# EAGLE design supervisor (EAGLE 5.08)
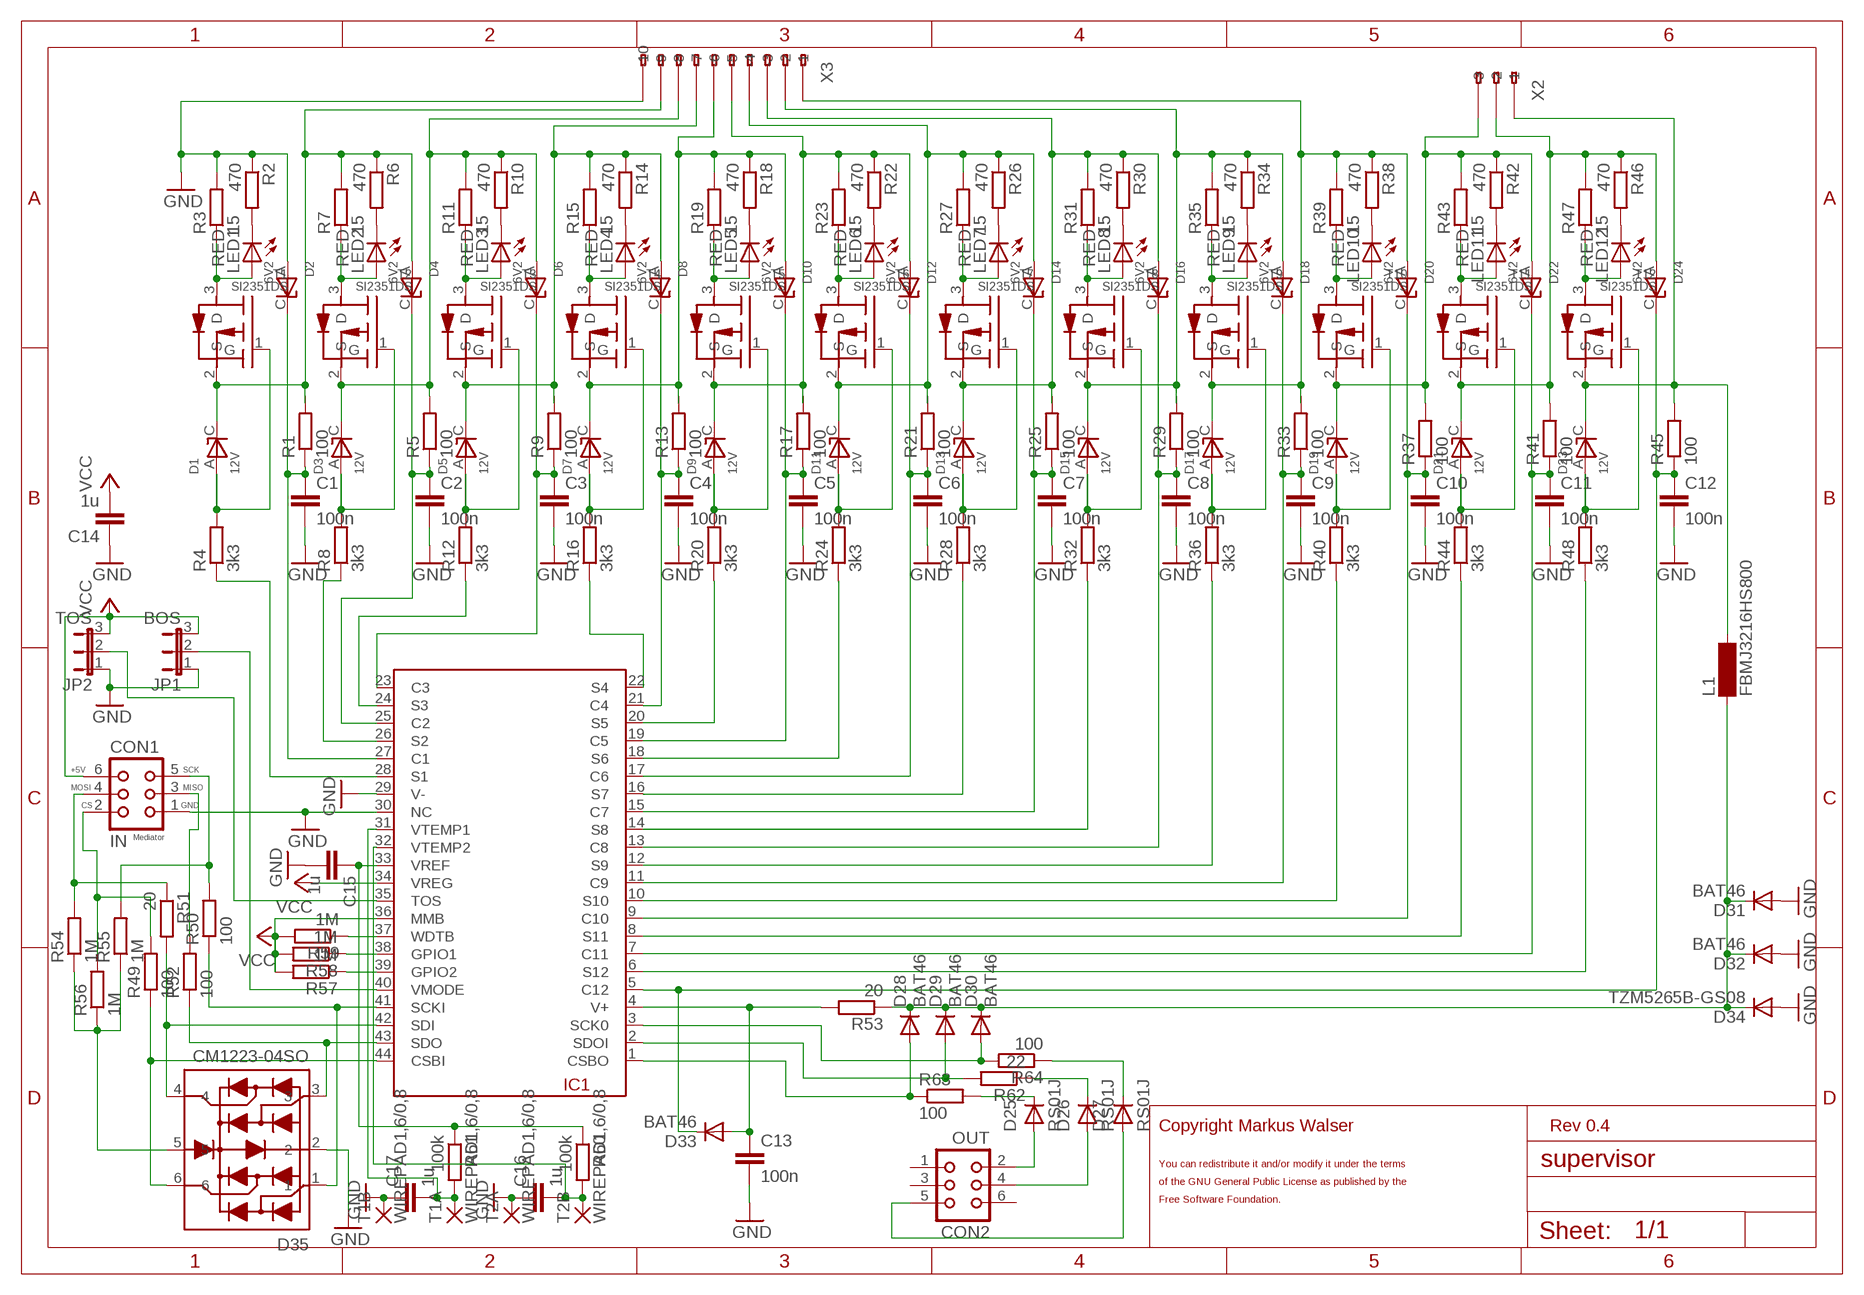
[diagram p0: schematic, sheet 1]

## Parts
C1  100n  C-EUC0603  [C0603]
C2  100n  C-EUC0603  [C0603]
C3  100n  C-EUC0603  [C0603]
C4  100n  C-EUC0603  [C0603]
C5  100n  C-EUC0603  [C0603]
C6  100n  C-EUC0603  [C0603]
C7  100n  C-EUC0603  [C0603]
C8  100n  C-EUC0603  [C0603]
C9  100n  C-EUC0603  [C0603]
C10  100n  C-EUC0603  [C0603]
C11  100n  C-EUC0603  [C0603]
C12  100n  C-EUC0603  [C0603]
C13  100n  C-EUC0603  [C0603]
C14  1u  C-EUC0603  [C0603]
C15  1u  C-EUC0603  [C0603]
C16  1u  C-EUC0603  [C0603]
C17  1u  C-EUC0603  [C0603]
CON1  IN  CON06L  [CON06L]
CON2  OUT  CON06L  [CON06L]
D1  12V  MM3Z12VT1  [SOD323-R]
D2  6V2  BZT52C6V2S  [SOD323-R]
D3  12V  MM3Z12VT1  [SOD323-R]
D4  6V2  BZT52C6V2S  [SOD323-R]
D5  12V  MM3Z12VT1  [SOD323-R]
D6  6V2  BZT52C6V2S  [SOD323-R]
D7  12V  MM3Z12VT1  [SOD323-R]
D8  6V2  BZT52C6V2S  [SOD323-R]
D9  12V  MM3Z12VT1  [SOD323-R]
D10  6V2  BZT52C6V2S  [SOD323-R]
D11  12V  MM3Z12VT1  [SOD323-R]
D12  6V2  BZT52C6V2S  [SOD323-R]
D13  12V  MM3Z12VT1  [SOD323-R]
D14  6V2  BZT52C6V2S  [SOD323-R]
D15  12V  MM3Z12VT1  [SOD323-R]
D16  6V2  BZT52C6V2S  [SOD323-R]
D17  12V  MM3Z12VT1  [SOD323-R]
D18  6V2  BZT52C6V2S  [SOD323-R]
D19  12V  MM3Z12VT1  [SOD323-R]
D20  6V2  BZT52C6V2S  [SOD323-R]
D21  12V  MM3Z12VT1  [SOD323-R]
D22  6V2  BZT52C6V2S  [SOD323-R]
D23  12V  MM3Z12VT1  [SOD323-R]
D24  6V2  BZT52C6V2S  [SOD323-R]
D25  RS01J  RS1J  [SMA-DO214AC]
D26  RS01J  RS1J  [SMA-DO214AC]
D27  RS01J  RS1J  [SMA-DO214AC]
D28  BAT46  DIODE-MINIMELF  [MINIMELF]
D29  BAT46  DIODE-MINIMELF  [MINIMELF]
D30  BAT46  DIODE-MINIMELF  [MINIMELF]
D31  BAT46  DIODE-MINIMELF  [MINIMELF]
D32  BAT46  DIODE-MINIMELF  [MINIMELF]
D33  BAT46  DIODE-MINIMELF  [MINIMELF]
D34  TZM5265B-GS08  DIODE-MINIMELF  [MINIMELF]
D35  CM1223-04SO  CM1223-04SOSOT23-6  [SOT23-6]
IC1  LTC6802-1  [SSOP44DL]
JP1  BOS  JP2E  [JP2]
JP2  TOS  JP2E  [JP2]
L1  FBMJ3216HS800  SM-1206  [SM-1206]
LED1  RED  LEDCHIPLED_0805  [CHIPLED_0805]
LED2  RED  LEDCHIPLED_0805  [CHIPLED_0805]
LED3  RED  LEDCHIPLED_0805  [CHIPLED_0805]
LED4  RED  LEDCHIPLED_0805  [CHIPLED_0805]
LED5  RED  LEDCHIPLED_0805  [CHIPLED_0805]
LED6  RED  LEDCHIPLED_0805  [CHIPLED_0805]
LED7  RED  LEDCHIPLED_0805  [CHIPLED_0805]
LED8  RED  LEDCHIPLED_0805  [CHIPLED_0805]
LED9  RED  LEDCHIPLED_0805  [CHIPLED_0805]
LED10  RED  LEDCHIPLED_0805  [CHIPLED_0805]
LED11  RED  LEDCHIPLED_0805  [CHIPLED_0805]
LED12  RED  LEDCHIPLED_0805  [CHIPLED_0805]
R1  100  R-EU_R0603  [R0603]
R2  470  R-EU_R0603  [R0603]
R3  15  R-EU_0411/12  [0411/12]
R4  3k3  R-EU_R0603  [R0603]
R5  100  R-EU_R0603  [R0603]
R6  470  R-EU_R0603  [R0603]
R7  15  R-EU_0411/12  [0411/12]
R8  3k3  R-EU_R0603  [R0603]
R9  100  R-EU_R0603  [R0603]
R10  470  R-EU_R0603  [R0603]
R11  15  R-EU_0411/12  [0411/12]
R12  3k3  R-EU_R0603  [R0603]
R13  100  R-EU_R0603  [R0603]
R14  470  R-EU_R0603  [R0603]
R15  15  R-EU_0411/12  [0411/12]
R16  3k3  R-EU_R0603  [R0603]
R17  100  R-EU_R0603  [R0603]
R18  470  R-EU_R0603  [R0603]
R19  15  R-EU_0411/12  [0411/12]
R20  3k3  R-EU_R0603  [R0603]
R21  100  R-EU_R0603  [R0603]
R22  470  R-EU_R0603  [R0603]
R23  15  R-EU_0411/12  [0411/12]
R24  3k3  R-EU_R0603  [R0603]
R25  100  R-EU_R0603  [R0603]
R26  470  R-EU_R0603  [R0603]
R27  15  R-EU_0411/12  [0411/12]
R28  3k3  R-EU_R0603  [R0603]
R29  100  R-EU_R0603  [R0603]
R30  470  R-EU_R0603  [R0603]
R31  15  R-EU_0411/12  [0411/12]
R32  3k3  R-EU_R0603  [R0603]
R33  100  R-EU_R0603  [R0603]
R34  470  R-EU_R0603  [R0603]
R35  15  R-EU_0411/12  [0411/12]
R36  3k3  R-EU_R0603  [R0603]
R37  100  R-EU_R0603  [R0603]
R38  470  R-EU_R0603  [R0603]
R39  15  R-EU_0411/12  [0411/12]
R40  3k3  R-EU_R0603  [R0603]
R41  100  R-EU_R0603  [R0603]
R42  470  R-EU_R0603  [R0603]
R43  15  R-EU_0411/12  [0411/12]
R44  3k3  R-EU_R0603  [R0603]
R45  100  R-EU_R0603  [R0603]
R46  470  R-EU_R0603  [R0603]
R47  15  R-EU_0411/12  [0411/12]
R48  3k3  R-EU_R0603  [R0603]
R49  100  R-EU_R0603  [R0603]
R50  100  R-EU_R0603  [R0603]
R51  20  R-EU_R0603  [R0603]
R52  100  R-EU_R0603  [R0603]
R53  20  R-EU_R0603  [R0603]
R54  1M  R-EU_R0603  [R0603]
R55  1M  R-EU_R0603  [R0603]
R56  1M  R-EU_R0603  [R0603]
R57  1M  R-EU_R0603  [R0603]
R58  1M  R-EU_R0603  [R0603]
R59  1M  R-EU_R0603  [R0603]
R60  100k  R-EU_R0603  [R0603]
R61  100k  R-EU_R0603  [R0603]
R62  22  R-EU_R0603  [R0603]
R63  100  R-EU_R0603  [R0603]
R64  100  R-EU_R0603  [R0603]
T1  SI2351DS  [SOT23]
T1A  WIREPAD1,6/0,8  [1,6/0,8]
T1B  WIREPAD1,6/0,8  [1,6/0,8]
T2  SI2351DS  [SOT23]
T2A  WIREPAD1,6/0,8  [1,6/0,8]
T2B  WIREPAD1,6/0,8  [1,6/0,8]
T3  SI2351DS  [SOT23]
T4  SI2351DS  [SOT23]
T5  SI2351DS  [SOT23]
T6  SI2351DS  [SOT23]
T7  SI2351DS  [SOT23]
T8  SI2351DS  [SOT23]
T9  SI2351DS  [SOT23]
T10  SI2351DS  [SOT23]
T11  SI2351DS  [SOT23]
T12  SI2351DS  [SOT23]
X2  233-503  [233-503]
X3  233-510  [233-510]

## Nets
GND: C1.2 C2.2 C3.2 C4.2 C5.2 C6.2 C7.2 C8.2 C9.2 C10.2 C11.2 C12.2 C13.2 C14.1 C15.2 C16.1 C17.1 CON1.1 D2.A D31.A D32.A D34.A D35.2 IC1.29(V-) IC1.30(NC) JP1.1 JP2.1 R2.1 R3.2 T1B.1(P) T2A.1(P) X3.A10(-10)
N$1: LED1.C R2.2
N$2: D1.A R4.2 T1.1(G)
N$3: LED1.A R3.1 T1.3(D)
N$4: C1.1 D2.C(K) IC1.27(C1) R1.1
N$5: D1.C(K) D4.A R1.2 R6.1 R7.2 T1.2(S) X3.A9(-9)
N$6: C2.1 D4.C(K) IC1.25(C2) R5.1
N$7: IC1.28(S1) R4.1
N$8: IC1.26(S2) R8.1
N$9: C5.1 D10.C(K) IC1.19(C5) R17.1
N$10: D3.A R8.2 T2.1(G)
N$11: LED2.A R7.1 T2.3(D)
N$12: LED2.C R6.2
N$13: D3.C(K) D6.A R5.2 R10.1 R11.2 T2.2(S) X3.A8(-8)
N$14: C3.1 D6.C(K) IC1.23(C3) R9.1
N$15: IC1.24(S3) R12.1
N$16: IC1.20(S5) R20.1
N$17: D5.A R12.2 T3.1(G)
N$18: LED3.A R11.1 T3.3(D)
N$19: LED3.C R10.2
N$20: D5.C(K) D8.A R9.2 R14.1 R15.2 T3.2(S) X3.A7(-7)
N$21: C4.1 D8.C(K) IC1.21(C4) R13.1
N$22: IC1.22(S4) R16.1
N$23: D9.A R20.2 T5.1(G)
N$24: D7.A R16.2 T4.1(G)
N$25: LED4.A R15.1 T4.3(D)
N$26: LED4.C R14.2
N$27: D7.C(K) D10.A R13.2 R18.1 R19.2 T4.2(S) X3.A6(-6)
N$28: D28.A IC1.1(CSBO) R63.1
N$29: LED5.A R19.1 T5.3(D)
N$30: LED5.C R18.2
N$31: D9.C(K) D12.A R17.2 R22.1 R23.2 T5.2(S) X3.A5(-5)
N$32: D29.A IC1.2(SDOI) R62.2
N$33: C6.1 D12.C(K) IC1.17(C6) R21.1
N$34: IC1.18(S6) R24.1
N$35: D11.A R24.2 T6.1(G)
N$36: LED6.A R23.1 T6.3(D)
N$37: LED6.C R22.2
N$38: D11.C(K) D14.A R21.2 R26.1 R27.2 T6.2(S) X3.A4(-4)
N$39: D30.A IC1.3(SCK0) R64.2
N$40: C7.1 D14.C(K) IC1.15(C7) R25.1
N$41: IC1.16(S7) R28.1
N$42: D13.A R28.2 T7.1(G)
N$43: LED7.A R27.1 T7.3(D)
N$44: LED7.C R26.2
N$45: D13.C(K) D16.A R25.2 R30.1 R31.2 T7.2(S) X3.A3(-3)
N$46: D35.1 IC1.41(SCKI) R50.1
N$47: C8.1 D16.C(K) IC1.13(C8) R29.1
N$48: IC1.14(S8) R32.1
N$49: D15.A R32.2 T8.1(G)
N$50: LED8.A R31.1 T8.3(D)
N$51: LED8.C R30.2
N$52: D15.C(K) D18.A R29.2 R34.1 R35.2 T8.2(S) X3.A2(-2)
N$53: D35.4 IC1.42(SDI) R51.2
N$54: C9.1 D18.C(K) IC1.11(C9) R33.1
N$55: IC1.12(S9) R36.1
N$56: D17.A R36.2 T9.1(G)
N$57: LED9.A R35.1 T9.3(D)
N$58: LED9.C R34.2
N$59: D17.C(K) D20.A R33.2 R38.1 R39.2 T9.2(S) X3.A1(-1)
N$60: D35.3 IC1.43(SDO) R52.1
N$61: C10.1 D20.C(K) IC1.9(C10) R37.1
N$62: IC1.10(S10) R40.1
N$63: D19.A R40.2 T10.1(G)
N$64: LED10.A R39.1 T10.3(D)
N$65: LED10.C R38.2
N$66: D19.C(K) D22.A R37.2 R42.1 R43.2 T10.2(S) X2.A3(-3)
N$67: D35.6 IC1.44(CSBI) R49.1
N$68: C11.1 D22.C(K) IC1.7(C11) R41.1
N$69: IC1.8(S11) R44.1
N$70: D21.A R44.2 T11.1(G)
N$71: LED11.A R43.1 T11.3(D)
N$72: LED11.C R42.2
N$73: D28.C D29.C D30.C D31.C D32.C D34.C L1.1 R53.1
N$74: D27.K(C) R64.1
N$75: C12.1 D24.C(K) D33.C IC1.5(C12) R45.1
N$76: IC1.6(S12) R48.1
N$77: D23.A R48.2 T12.1(G)
N$78: LED12.A R47.1 T12.3(D)
N$79: LED12.C R46.2
N$80: D23.C(K) L1.2 R45.2 T12.2(S) X2.A1(-1)
N$81: CON2.5 D27.A
N$82: D26.K(C) R62.1
N$83: C13.1 D33.A IC1.4(V+) R53.2
N$84: D21.C(K) D24.A R41.2 R46.1 R47.2 T11.2(S) X2.A2(-2)
N$85: IC1.35(TOS) JP2.2
N$86: D35.5 R54.1 R55.1 R56.1
N$87: IC1.37(WDTB) R59.1
N$88: IC1.38(GPIO1) R58.1
N$89: IC1.39(GPIO2) R57.1
N$90: C15.1 IC1.33(VREF) R60.1 R61.1
N$91: IC1.40(VMODE) JP1.2
N$92: CON1.2 R49.2 R56.2
N$93: CON1.3 R52.2
N$94: CON1.4 R51.1 R54.2
N$95: CON1.5 R50.2 R55.2
N$96: C16.2 IC1.32(VTEMP2) R60.2 T2B.1(P)
N$97: C17.2 IC1.31(VTEMP1) R61.2 T1A.1(P)
N$98: CON2.4 D26.A
N$99: D25.K(C) R63.2
N$100: CON2.2 D25.A
VCC: C14.2 CON1.6 IC1.34(VREG) IC1.36(MMB) JP1.3 JP2.3 R57.2 R58.2 R59.2
Unconnected: CON2.1 CON2.3 CON2.6 X2.B1(B-1) X2.B2(B-2) X2.B3(B-3) X3.B1(B-1) X3.B2(B-2) X3.B3(B-3) X3.B4(B-4) X3.B5(B-5) X3.B6(B-6) X3.B7(B-7) X3.B8(B-8) X3.B9(B-9) X3.B10(B-10)

## Notes on the sheet
- +5V | SCK
- MOSI | MISO
- CS | GND
- Mediator
- Copyright Markus Walser | Rev 0.4
- You can redistribute it and/or modify it under the terms
- of the GNU General Public License as published by the
- Free Software Foundation.

## Library data of the parts
C1-C17 = resistor:C-EU: CAPACITOR, European symbol
CON1 CON2 = con-harting:CON06L: CONNECTOR
D1 D3 D5 D7 D9 D11 D13 D15 D17 D19 D21 D23 = icontroller:MM3Z12VT1: 12V Z-Diode
D2 D4 D6 D8 D10 D12 D14 D16 D18 D20 D22 D24 = icontroller:BZT52C6V2S: 6.2V Z-Diode
D25-D27 = icontroller:RS1J
D28-D34 = diode:DIODE-: DIODE
D35 = icontroller:CM1223-04SO: CMD LOW CAPACITANCE ESD PROTECTION ARRAYS WITH BACKDRIVE PROTECTION
IC1 = ltc6802:LTC6802-1
JP1 JP2 = jumper:JP2E: JUMPER
L1 = inductor-neosid:SM-1206: INDUCTOR SMD chip inductor
LED1-LED12 = led:LED: LED OSRAM: - CHIPLED LG R971, LG N971, LY N971, LG Q971, LY Q971, LO R971, LY R971 LH N974, LH R974 LS Q976, LO Q976, LY Q976 LO Q996 - Hyper CHIPLED LW Q18S LB Q993, LB Q99A, LB R99A - SideLED LS A670, LO A670, LY A670, LG A670, LP A670 LB A673, LV A673, LT A673, LW A673 LH A674 LY A675 LS A676, LA A676, LO A676, LY A676, LW A676 LS A679, LY A679, LG A679 - Hyper Micro SIDELED® LS Y876, LA Y876, LO Y876, LY Y876 LT Y87S - SmartLED LW L88C, LW L88S LB L89C, LB L89S, LG L890 LS L89K, LO L89K, LY L89K LS L896, LA L896, LO L896, LY L896 - TOPLED LS T670, LO T670, LY T670, LG T670, LP T670 LSG T670, LSP T670, LSY T670, LOP T670, LYG T670 LG T671, LOG T671, LSG T671 LB T673, LV T673, LT T673, LW T673 LH T674 LS T676, LA T676, LO T676, LY T676, LB T676, LH T676, LSB T676, LW T676 LB T67C, LV T67C, LT T67C, LS T67K, LO T67K, LY T67K, LW E67C LS E67B, LA E67B, LO E67B, LY E67B, LB E67C, LV E67C, LT E67C LW T67C LS T679, LY T679, LG T679 LS T770, LO T770, LY T770, LG T770, LP T770 LB T773, LV T773, LT T773, LW T773 LH T774 LS E675, LA E675, LY E675, LS T675 LS T776, LA T776, LO T776, LY T776, LB T776 LHGB T686 LT T68C, LB T68C - Hyper Mini TOPLED® LB M676 - Mini TOPLED Santana® LG M470 LS M47K, LO M47K, LY M47K Source: http://www.osram.convergy.de LUXEON: - LUMILED® LXK2-PW12-R00, LXK2-PW12-S00, LXK2-PW14-U00, LXK2-PW14-V00 LXK2-PM12-R00, LXK2-PM12-S00, LXK2-PM14-U00 LXK2-PE12-Q00, LXK2-PE12-R00, LXK2-PE12-S00, LXK2-PE14-T00, LXK2-PE14-U00 LXK2-PB12-K00, LXK2-PB12-L00, LXK2-PB12-M00, LXK2-PB14-N00, LXK2-PB14-P00, LXK2-PB14-Q00 LXK2-PR12-L00, LXK2-PR12-M00, LXK2-PR14-Q00, LXK2-PR14-R00 LXK2-PD12-Q00, LXK2-PD12-R00, LXK2-PD12-S00 LXK2-PH12-R00, LXK2-PH12-S00 LXK2-PL12-P00, LXK2-PL12-Q00, LXK2-PL12-R00 Source: www.luxeon.com KINGBRIGHT: KA-3528ASYC Source: www.kingbright.com
R1-R64 = resistor:R-EU_: RESISTOR, European symbol
T1-T12 = icontroller:SI2351DS
T1A T1B T2A T2B = wirepad:WIREPAD: Wire PAD connect wire on PCB
X2 = con-wago:233-503: WAGO Cage Clamp
X3 = con-wago:233-510: WAGO Cage Clamp

## Board
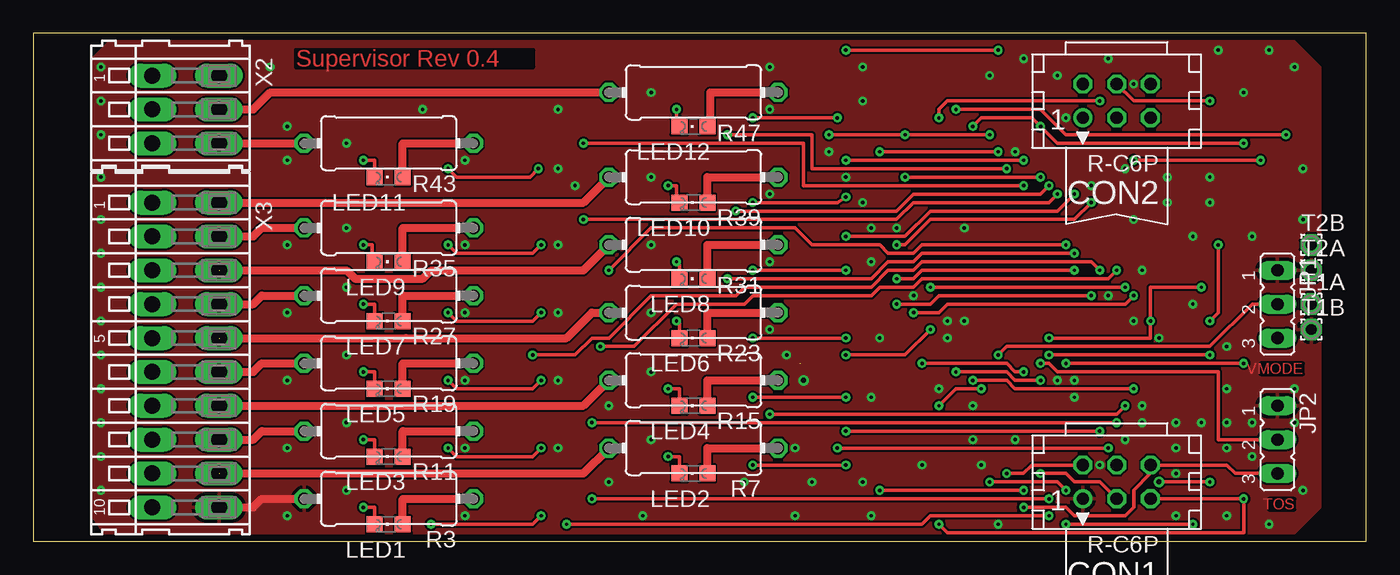
[diagram p1: board, top side]
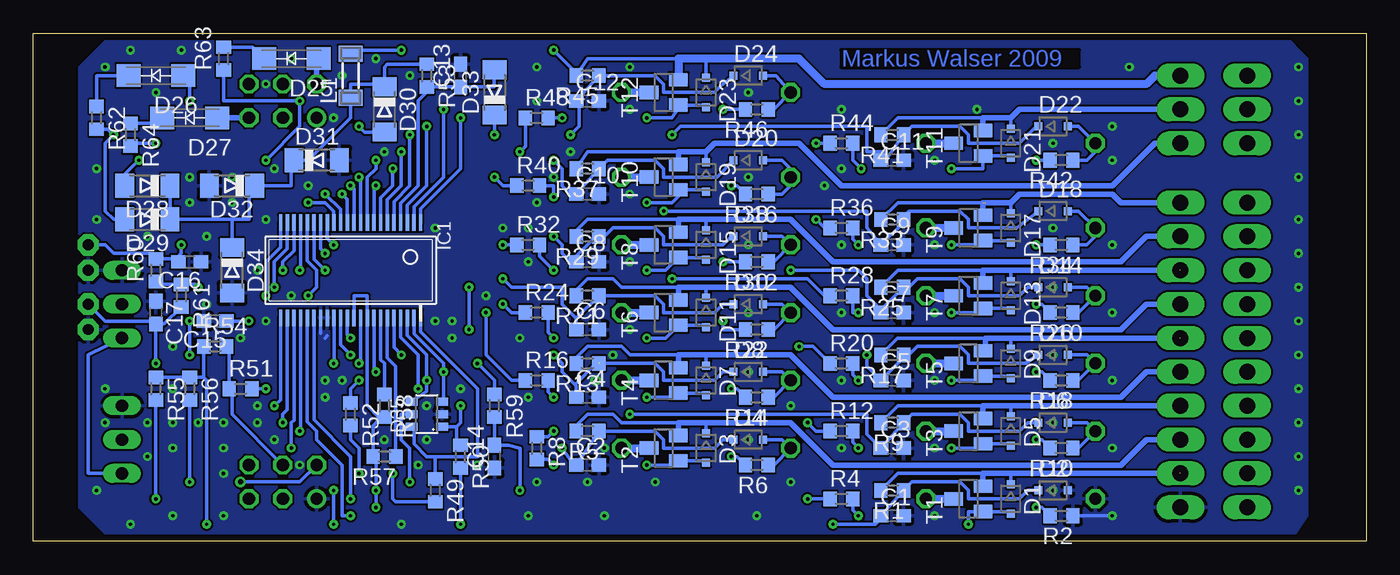
[diagram p2: board, bottom side, seen from below]

Size 100 x 38.09 mm. Coordinates in mm from the lower left corner, seen from the top.
Outline: 0,0 100,0 100,38.09 0,38.09 0,0
Copper layers (1*16): Top 0.035mm / dielectric 1.5mm / Bottom 0.035mm
Design rules "default *": minimum track width 6mil, minimum drill 10mil, track to track 6mil, track to pad 6mil, pad to pad 6mil, via to via 6mil, smd to smd 6mil, copper to edge 20mil, drill to drill 8mil, minimum pad ring 10mil, minimum via ring 8mil, stop-mask expansion 4mil, vias tented up to drill 25mil, thermal gap 10mil

### Footprints (pad centres in the part's own frame; a part is rotated, then mirrored left to right if it is on the bottom)
C0603 = smd 1.1 x 1: 1 -0.85,0; 2 0.85,0
CON06L = drill 0.914 round: 1 2.54,1.27 | drill 0.914 octagon: 2 2.54,-1.27; 3 0,1.27; 4 0,-1.27; 5 -2.54,1.27; 6 -2.54,-1.27
SOD323-R = smd 0.6 x 0.6: A 1.1,0; C -1.1,0
SMA-DO214AC = smd 1.8 x 1.7: A -2.05,0; K 2.05,0
MINIMELF = smd 1.4 x 1.8: A 1.7,0; C -1.7,0
SOT23-6 = smd 0.6 x 0.9: 1 -0.95,-1.15; 2 0,-1.15; 3 0.95,-1.15; 4 0.95,1.15; 5 0,1.15; 6 -0.95,1.15
SSOP44DL = smd 0.25 x 1.25: 1 -5.25,-3.575; 2 -4.75,-3.575; 3 -4.25,-3.575; 4 -3.75,-3.575; 5 -3.25,-3.575; 6 -2.75,-3.575; 7 -2.25,-3.575; 8 -1.75,-3.575; 9 -1.25,-3.575; 10 -0.75,-3.575; 11 -0.25,-3.575; 12 0.25,-3.575; 13 0.75,-3.575; 14 1.25,-3.575; 15 1.75,-3.575; 16 2.25,-3.575; 17 2.75,-3.575; 18 3.25,-3.575; 19 3.75,-3.575; 20 4.25,-3.575; 21 4.75,-3.575; 22 5.25,-3.575; 23 5.25,3.575; 24 4.75,3.575; 25 4.25,3.575; 26 3.75,3.575; 27 3.25,3.575; 28 2.75,3.575; 29 2.25,3.575; 30 1.75,3.575; 31 1.25,3.575; 32 0.75,3.575; 33 0.25,3.575; 34 -0.25,3.575; 35 -0.75,3.575; 36 -1.25,3.575; 37 -1.75,3.575; 38 -2.25,3.575; 39 -2.75,3.575; 40 -3.25,3.575; 41 -3.75,3.575; 42 -4.25,3.575; 43 -4.75,3.575; 44 -5.25,3.575
JP2 = drill 0.914 long: 1 -2.54,0; 2 0,0; 3 2.54,0
SM-1206 = smd 1.2 x 1.8: 1 -1.65,0; 2 1.65,0
CHIPLED_0805 = smd 1.2 x 1.2: A 0,-1.05; C 0,1.05
R0603 = smd 1 x 1.1: 1 -0.85,0; 2 0.85,0
0411/12 = drill 0.914 octagon: 1 -6.35,0; 2 6.35,0
SOT23 = smd 1 x 1.4: 1 -0.95,-1.1; 2 0.95,-1.1; 3 0,1.1
1,6/0,8 = drill 0.813 pad 1.6 octagon: 1 0,0
233-503 = drill 1.2 long: A1 -2.54,2.5; A2 0,2.5; A3 2.54,2.5; B1 -2.54,-2.5; B2 0,-2.5; B3 2.54,-2.5
233-510 = drill 1.2 long: A1 -11.43,2.5; A2 -8.89,2.5; A3 -6.35,2.5; A4 -3.81,2.5; A5 -1.27,2.5; A6 1.27,2.5; A7 3.81,2.5; A8 6.35,2.5; A9 8.89,2.5; A10 11.43,2.5; B1 -11.43,-2.5; B2 -8.89,-2.5; B3 -6.35,-2.5; B4 -3.81,-2.5; B5 -1.27,-2.5; B6 1.27,-2.5; B7 3.81,-2.5; B8 6.35,-2.5; B9 8.89,-2.5; B10 11.43,-2.5

### Placement (x,y rotation side)
C1  35.56,1.91 0 bottom
C2  58.42,5.71 0 bottom
C3  35.56,6.99 0 bottom
C4  58.42,10.79 0 bottom
C5  35.56,12.06 0 bottom
C6  58.42,15.88 0 bottom
C7  35.56,17.14 0 bottom
C8  58.42,20.95 0 bottom
C9  35.56,22.23 0 bottom
C10  58.42,26.04 0 bottom
C11  35.56,28.57 0 bottom
C12  58.42,33.02 0 bottom
C13  67.94,34.92 90 bottom
C14  65.41,6.35 90 bottom
C15  86.36,16.51 180 bottom
C16  88.27,20.95 180 bottom
C17  90.81,17.14 270 bottom
CON1  81.28,4.45 180 top
CON2  81.28,33.02 180 top
D1  26.67,3.17 270 bottom
D2  23.5,3.81 0 bottom
D3  49.53,6.99 270 bottom
D4  46.35,7.62 0 bottom
D5  26.67,8.26 270 bottom
D6  23.5,8.89 0 bottom
D7  49.53,12.06 270 bottom
D8  46.35,12.7 0 bottom
D9  26.67,13.34 270 bottom
D10  23.5,13.97 0 bottom
D11  49.53,17.14 270 bottom
D12  46.35,17.78 0 bottom
D13  26.67,18.41 270 bottom
D14  23.5,19.05 0 bottom
D15  49.53,22.23 270 bottom
D16  46.35,22.86 0 bottom
D17  26.67,23.5 270 bottom
D18  23.5,24.77 0 bottom
D19  49.53,27.3 270 bottom
D20  46.35,28.57 0 bottom
D21  26.67,29.84 270 bottom
D22  23.5,31.11 0 bottom
D23  49.53,33.66 270 bottom
D24  46.35,34.92 0 bottom
D25  80.64,36.2 180 bottom
D26  90.81,34.92 180 bottom
D27  88.27,31.75 180 bottom
D28  91.44,26.67 180 bottom
D29  91.44,24.13 180 bottom
D30  73.66,32.38 270 bottom
D31  78.74,28.57 0 bottom
D32  85.09,26.67 180 bottom
D33  65.41,33.66 90 bottom
D34  85.09,20.32 270 bottom
D35  70.48,9.53 90 bottom
IC1  76.2,20.32 180 bottom
JP1  93.34,17.78 270 top
JP2  93.34,7.62 270 top
L1  76.2,34.92 90 bottom
LED1  26.67,1.27 90 top
LED2  49.53,5.08 90 top
LED3  26.67,6.35 90 top
LED4  49.53,10.16 90 top
LED5  26.67,11.43 90 top
LED6  49.53,15.24 90 top
LED7  26.67,16.51 90 top
LED8  49.53,19.68 90 top
LED9  26.67,20.95 90 top
LED10  49.53,25.4 90 top
LED11  26.67,27.3 90 top
LED12  49.53,31.11 90 top
R1  35.56,3.81 180 bottom
R2  22.86,1.91 180 bottom
R3  26.67,3.17 180 top
R4  39.37,3.17 0 bottom
R5  58.42,8.26 180 bottom
R6  45.72,5.71 180 bottom
R7  49.53,6.99 180 top
R8  62.23,6.99 270 bottom
R9  35.56,8.89 180 bottom
R10  22.86,6.99 180 bottom
R11  26.67,8.26 180 top
R12  39.37,8.26 0 bottom
R13  58.42,13.34 180 bottom
R14  45.72,10.79 180 bottom
R15  49.53,12.06 180 top
R16  62.23,12.06 0 bottom
R17  35.56,13.97 180 bottom
R18  22.86,12.06 180 bottom
R19  26.67,13.34 180 top
R20  39.37,13.34 0 bottom
R21  58.42,18.41 180 bottom
R22  45.72,15.88 180 bottom
R23  49.53,17.14 180 top
R24  62.23,17.14 0 bottom
R25  35.56,19.05 180 bottom
R26  22.86,17.14 180 bottom
R27  26.67,18.41 180 top
R28  39.37,18.41 0 bottom
R29  58.42,22.86 180 bottom
R30  45.72,20.95 180 bottom
R31  49.53,22.23 180 top
R32  62.87,22.23 0 bottom
R33  35.56,24.13 180 bottom
R34  22.86,22.23 180 bottom
R35  26.67,23.5 180 top
R36  39.37,23.5 0 bottom
R37  58.42,27.94 180 bottom
R38  45.72,26.04 180 bottom
R39  49.53,27.3 180 top
R40  62.87,26.67 0 bottom
R41  35.56,30.48 180 bottom
R42  22.86,28.57 180 bottom
R43  26.67,29.84 180 top
R44  39.37,29.84 0 bottom
R45  58.42,34.92 180 bottom
R46  45.72,32.38 180 bottom
R47  49.53,33.66 180 top
R48  62.23,31.75 0 bottom
R49  69.85,3.81 270 bottom
R50  67.94,6.35 270 bottom
R51  84.45,11.43 0 bottom
R52  76.2,9.53 270 bottom
R53  70.48,34.92 270 bottom
R54  86.36,14.61 0 bottom
R55  90.81,11.43 270 bottom
R56  88.27,11.43 270 bottom
R57  73.66,6.35 180 bottom
R58  73.66,10.16 270 bottom
R59  65.41,10.16 270 bottom
R60  90.81,20.32 90 bottom
R61  88.9,18.41 270 bottom
R62  95.25,31.75 270 bottom
R63  85.72,36.2 90 bottom
R64  92.71,30.48 270 bottom
T1  29.84,3.17 90 bottom
T1A  95.89,17.78 0 top
T1B  95.89,15.88 0 top
T2  52.7,6.99 90 bottom
T2A  95.89,20.32 0 top
T2B  95.89,22.23 0 top
T3  29.84,8.26 90 bottom
T4  52.7,12.06 90 bottom
T5  29.84,13.34 90 bottom
T6  52.7,17.14 90 bottom
T7  29.84,18.41 90 bottom
T8  52.7,22.23 90 bottom
T9  29.84,23.5 90 bottom
T10  52.7,27.3 90 bottom
T11  29.84,29.84 90 bottom
T12  52.7,33.66 90 bottom
X2  11.43,32.38 270 top
X3  11.43,13.97 270 top

### Tracks (layer width: path | path; a pad name or v marks a point on that pad's centre or on a via)
GND  (via drill 0.25 pad 0.25, 0.38 pad 0.25)
  Top 0.61: R3.2 17.14,3.17 16.51,2.54 X3.A10
  Bottom 0.254: 21.59,1.91 R2.1 v19.05,1.91 | 77.95,15.39 78.11,15.24 | IC1.29 78.45,15.59
  other vias: 19.05,6.99 19.05,12.06 19.05,17.14 19.05,22.23 19.05,28.57 17.78,35.56 32.38,28.57 39.37,17.14 39.37,22.23 39.37,12.06 39.37,6.99 32.38,1.91 43.18,4.45 62.23,4.45 63.5,15.24 62.87,10.79 57.15,6.99 57.78,12.06 55.24,15.88 62.87,23.5 55.24,20.95 62.87,20.95 32.38,12.06 32.38,6.99 39.37,27.94 32.38,22.23 32.38,17.14 55.24,26.04 55.24,32.38 39.37,32.38 62.23,35.56 59.69,29.21 62.23,33.02 64.77,23.5 79.38,26.67 74.3,36.2 85.09,27.3 90.81,33.66 87,22.86 91.44,22.86 92.71,36.83 67.94,11.43 70.48,10.16 71.12,5.71 62.87,1.91 5.08,35.56 5.08,33.02 5.08,30.48 5.08,27.3 5.08,24.13 5.08,21.59 5.08,19.05 5.08,16.51 5.08,13.97 5.08,11.43 5.08,8.89 5.08,6.35 5.08,3.81 66.67,5.71 78.11,10.79 85.72,8.89 89.53,1.91 85.72,6.99 92.71,1.27 85.09,25.4 19.05,31.11 87,17.78 85.72,5.08 89.53,8.89 88.27,25.4 45.72,1.91 57.15,1.91 73.66,29.21 88.9,36.83 88.27,27.3 95.25,27.94 80.64,36.2 94.61,35.56 77.47,31.75 72.39,1.27 69.85,16.51 66.04,18.41 40.64,26.67 55.24,35.56 43.18,10.16 23.5,13.97 23.5,8.89 23.5,19.05 23.5,23.5 23.5,29.84 46.35,33.66 46.35,27.3 46.35,22.23 46.35,12.7 46.35,7.62 46.35,17.14 62.23,25.4 58.42,4.45 53.34,4.45 83.19,20.32 85.72,1.91 76.83,34.92 68.58,15.24 69.85,23.5 80.64,18.41 81.92,7.62 83.19,8.89 80.01,5.71 82.55,34.29 71.75,34.92 68.58,16.51 82.55,16.51 89.53,14.61 84.45,15.24 89.53,11.43 87.63,8.89 60.96,27.3 70.48,7.62 73.66,7.62 95.25,24.13 82.55,24.13 56.52,13.97 76.83,12.06 23.5,3.81 29.21,32.38 83.19,10.16 89.53,6.99 91.44,6.35 91.44,8.89 94.61,8.89 94.61,11.43 95.25,3.81 78.11,12.06 81.92,27.94
  pour Bottom: 6.35,38.1 93.98,38.1 96.52,35.56 96.52,2.54 93.98,0 5.71,0 4.45,1.91 4.45,36.2
  pour Top: 6.35,38.1 93.98,38.1 96.52,35.56 96.52,2.54 93.98,0 5.71,0 4.45,1.91 4.45,36.2
N$1  (via drill 0.25 pad 0.25)
  Top 0.254: v24.77,2.54 25.62,2.54 LED1.C
  Bottom 0.254: R2.2 24.34,2.54 v24.77,2.54
N$2  (via drill 0.25 pad 0.25)
  Top 0.254: v29.84,1.27 37.47,1.27 v38.1,1.91
  Bottom 0.254: D1.A 26.54,2.23 T1.1 29.84,2.23 v29.84,1.27 | v38.1,1.91 38.52,2.33 R4.2
N$3
  Top 0.61: LED1.A 27.72,3.17 R3.1
  Bottom 0.61: R3.1 T1.3
N$4  (via drill 0.25)
  Top 0.254: v40.01,1.27 66.67,1.27 67.31,1.91 v76.2,1.91
  Bottom 0.254: 34.8,3.7 R1.1 | 34.8,3.7 C1.1 36.41,1.69 36.83,1.27 v40.01,1.27 | D2.C 25.4,3.81 26.04,3.17 29.84,3.17 29.84,3.81 30.48,4.45 34.06,4.45 34.8,3.7 | v76.2,1.91 76.83,1.91 76.83,5.71 78.74,7.62 78.74,8.26 79.45,8.96 IC1.27
N$5  (1 unrouted)
  Top 0.61: R7.2 41.27,5.08 X3.A9
  Bottom 0.254: D4.A 43.81,7.62 R7.2 44.45,5.71 R6.1 | R1.2 35.14,5.08 28.57,5.08 | 26.67,5.08 D1.C
  Bottom 0.406: 13.97,5.08 26.67,5.08 28.57,5.08 28.75,5.08 T1.2
N$6  (via drill 0.25)
  Top 0.254: v60.33,6.99 v80.64,6.99
  Bottom 0.254: D4.C 48.26,7.62 48.9,6.99 52.7,6.99 52.7,7.62 53.34,8.26 R5.1 C2.1 59.27,5.5 v60.33,6.99 | v80.64,6.99 80.64,8.89 80.45,9.09 IC1.25
N$7  (via drill 0.25)
  Top 0.254: v41.91,3.17 v76.2,3.17
  Bottom 0.254: v76.2,3.17 76.2,6.35 78.95,9.1 IC1.28 | R4.1 v41.91,3.17
N$8  (via drill 0.25)
  Top 0.254: v60.96,8.26 v80.01,8.26
  Bottom 0.254: R8.1 61.38,7.83 v60.96,8.26 | IC1.26 79.95,8.31 v80.01,8.26
N$9  (via drill 0.25 pad 0.2, 0.25 pad 0.25)
  Top 0.254: v80.01,20.32 79.38,20.95 66.67,20.95 66.04,20.32 64.14,20.32 62.87,19.05 53.34,19.05 52.7,18.41 46.35,18.41 43.18,15.24 41.91,15.24 40.64,13.97 v37.47,13.97
  Bottom 0.254: D10.C 25.58,13.34 29.84,13.34 29.84,13.97 30.48,14.61 33.66,14.61 34.29,13.97 R17.1 34.71,13.77 C5.1 37.47,13.12 v37.47,13.97 | IC1.19 79.95,20.38 v80.01,20.32
N$10  (via drill 0.25 pad 0.25)
  Top 0.254: v53.98,5.71 v60.96,5.71
  Bottom 0.254: D3.A 49.4,6.04 T2.1 51.92,5.71 v53.98,5.71 | v60.96,5.71 61.38,6.13 R8.2
N$11
  Top 0.61: LED2.A 50.58,6.99 R7.1
  Bottom 0.61: R7.1 T2.3
N$12  (via drill 0.25 pad 0.25)
  Top 0.254: v47.62,6.35 48.48,6.35 LED2.C
  Bottom 0.254: v47.62,6.35 47.2,6.35 R6.2
N$13
  Top 0.61: R11.2 17.14,8.26 16.51,7.62 X3.A8
  Bottom 0.254: D6.A 20.95,8.89 R11.2 21.59,6.99 R10.1 | R5.2 59.27,8.68 58.42,9.53 56.52,9.53 55.88,8.89 49.53,8.89 D3.C
  Bottom 0.406: X3.A8 16.51,7.62 18.41,5.71 25.4,5.71 27.94,5.71 40.01,5.71 43.18,8.89 49.53,8.89 51.6,8.89 T2.2
N$14  (via drill 0.25, 0.25 pad 0.25)
  Top 0.254: v55.24,9.53 81.28,9.53 v81.92,10.16
  Bottom 0.254: D6.C 25.4,8.89 26.04,8.26 29.84,8.26 29.84,8.89 30.48,9.53 34.08,9.53 R9.1 C3.1 37.47,8.04 37.47,9.53 v55.24,9.53 | v81.92,10.16 81.45,10.62 IC1.23
N$15  (via drill 0.25, 0.25 pad 0.25)
  Top 0.254: v41.91,8.89 v81.28,8.89
  Bottom 0.254: R12.1 41.27,8.26 v41.91,8.89 | v81.28,8.89 81.28,9.53 80.95,9.86 IC1.24
N$16  (via drill 0.25 pad 0.25)
  Top 0.254: v81.28,20.32 80.64,19.68 66.67,19.68 66.04,19.05 63.5,19.05 62.87,18.41 53.98,18.41 53.34,17.78 48.26,17.78 45.09,14.61 v42.55,14.61
  Bottom 0.254: v42.55,14.61 41.49,14.61 R20.1 | v81.28,20.32 81.28,20.95 80.45,21.79 IC1.20
N$17  (via drill 0.25 pad 0.25)
  Top 0.254: v31.11,6.99 31.75,6.35 37.47,6.35 v38.1,6.99
  Bottom 0.254: D5.A 26.54,7.3 T3.1 29.07,6.99 v31.11,6.99 | v38.1,6.99 38.52,7.41 R12.2
N$18
  Top 0.61: LED3.A 27.72,8.26 R11.1
  Bottom 0.61: R11.1 T3.3
N$19  (via drill 0.25 pad 0.25)
  Top 0.254: LED3.C 25.62,7.62 v24.77,7.62
  Bottom 0.254: v24.77,7.62 24.34,7.62 R10.2
N$20
  Top 0.61: R15.2 41.27,10.16 X3.A7
  Bottom 0.254: D8.A 43.81,12.7 R15.2 44.45,10.79 R14.1 | R9.2 35.14,10.16 28.57,10.16 | 26.67,10.16 D5.C
  Bottom 0.406: X3.A7 26.67,10.16 28.57,10.16 28.75,10.16 T3.2
N$21  (via drill 0.25 pad 0.25)  (1 unrouted)
  Top 0.254: v60.96,13.97 65.41,13.97 v67.31,15.88 | v67.31,19.05 v81.92,19.05
  Bottom 0.254: D8.C 48.26,12.7 48.9,12.06 52.7,12.06 52.7,12.7 53.34,13.34 57.54,13.34 | C4.1 59.27,11.64 59.37,11.75 | 59.37,11.75 60.33,12.7 60.33,13.34 v60.96,13.97 | v67.31,15.88 v67.31,19.05 | R13.1 57.78,13.34 59.37,11.75 | v81.92,19.05 81.92,20.95 80.95,21.92 IC1.21
N$22  (via drill 0.25 pad 0.25)
  Top 0.254: v66.04,17.14 67.94,17.14 68.58,17.78 81.92,17.78 v82.55,18.41
  Bottom 0.254: v66.04,17.14 66.04,13.97 64.14,12.06 R16.1 | v82.55,18.41 82.55,20.95 81.45,22.05 IC1.22
N$23  (via drill 0.25 pad 0.25)
  Top 0.254: v31.11,12.06 31.75,11.43 37.47,11.43 v38.1,12.06
  Bottom 0.254: D9.A 26.54,12.38 T5.1 29.07,12.06 v31.11,12.06 | v38.1,12.06 38.52,12.48 R20.2
N$24  (via drill 0.25 pad 0.25)
  Top 0.254: v53.98,10.79 v60.96,10.79
  Bottom 0.254: D7.A 49.4,11.12 T4.1 51.92,10.79 v53.98,10.79 | v60.96,10.79 61.38,11.21 R16.2
N$25
  Top 0.61: LED4.A 50.58,12.06 R15.1
  Bottom 0.61: R15.1 T4.3
N$26  (via drill 0.25 pad 0.25)
  Top 0.254: v47.62,11.43 48.48,11.43 LED4.C
  Bottom 0.254: v47.62,11.43 47.2,11.43 R14.2
N$27
  Top 0.61: R19.2 17.14,13.34 16.51,12.7 X3.A6
  Bottom 0.254: D10.A 20.95,13.97 R19.2 21.59,12.06 R18.1 | R13.2 59.27,13.76 58.42,14.61 55.88,14.61 55.24,13.97 49.53,13.97 D7.C
  Bottom 0.406: X3.A6 16.51,12.7 18.41,10.79 40.01,10.79 43.18,13.97 49.53,13.97 51.6,13.97 T4.2
N$28  (via drill 0.25, 0.25 pad 0.25)
  Top 0.254: v67.94,31.75 67.94,32.38 68.58,33.02 v80.01,33.02 | v82.55,28.57 v92.08,28.57
  Bottom 0.254: R63.1 85.72,33.02 v80.01,33.02 80.01,31.11 v82.55,28.57 | v92.08,28.57 93.14,27.51 D28.A | v67.94,31.75 67.94,27.94 70.95,24.93 IC1.1
N$29
  Top 0.61: LED5.A 27.72,13.34 R19.1
  Bottom 0.61: R19.1 T5.3
N$30  (via drill 0.25 pad 0.25)
  Top 0.254: v24.77,12.7 25.62,12.7 LED5.C
  Bottom 0.254: v24.77,12.7 24.34,12.7 R18.2
N$31  (1 unrouted)
  Top 0.406: 27.94,15.24 27.92,15.22
  Top 0.61: R23.2 41.91,17.14 40.01,15.24 27.94,15.24 X3.A5
  Bottom 0.254: D12.A 43.81,17.78 R23.2 44.45,15.88 R22.1 | R17.2 35.16,15.22 26.67,15.22 | 26.67,15.22 26.21,15.22 26.21,15.24 | 26.67,15.22 D9.C
  Bottom 0.406: 13.97,15.24 26.04,15.24 | 26.04,15.24 26.21,15.24 | T5.2 28.57,14.29 28.57,15.24 26.04,15.24
N$32  (via drill 0.25)
  Top 0.254: v93.98,30.48 77.47,30.48 75.56,32.38 v69.22,32.38
  Bottom 0.254: D29.A 93.98,24.13 94.61,24.77 94.61,29.84 v93.98,30.48 94.4,30.9 R62.2 | v69.22,32.38 69.22,27.3 71.45,25.07 IC1.2
N$33  (via drill 0.25 pad 0.25)
  Top 0.254: v64.77,19.68 66.04,19.68 66.67,20.32 v78.11,20.32
  Bottom 0.254: D12.C 48.26,17.78 48.9,17.14 52.7,17.14 52.7,17.78 53.34,18.41 R21.1 59.27,16.71 | 59.27,16.71 C6.1 | v64.77,19.68 64.14,19.05 60.33,19.05 60.33,17.77 59.27,16.71 | v78.11,20.32 78.95,21.16 IC1.17
N$34  (via drill 0.25 pad 0.25)
  Top 0.254: v64.77,17.78 67.31,17.78 67.94,18.41 v79.38,18.41
  Bottom 0.254: R24.1 64.14,17.14 v64.77,17.78 | v79.38,18.41 78.74,19.05 78.74,20.32 79.45,21.03 IC1.18
N$35  (via drill 0.25 pad 0.25)
  Top 0.254: v53.98,15.24 v60.96,15.24
  Bottom 0.254: D11.A 49.4,16.2 T6.1 52.56,15.24 v53.98,15.24 | v60.96,15.24 61.38,15.66 R24.2
N$36
  Top 0.61: LED6.A 50.58,17.14 R23.1
  Bottom 0.61: R23.1 T6.3
N$37  (via drill 0.25 pad 0.25)
  Top 0.254: LED6.C 48.48,16.51 v48.26,16.51
  Bottom 0.254: v48.26,16.51 48.26,15.88 R22.2
N$38
  Top 0.61: R27.2 17.14,18.41 16.51,17.78 X3.A4
  Bottom 0.254: D14.A 20.95,19.05 R27.2 22.01,16.73 R26.1 | R21.2 59.27,18.84 58.42,19.68 56.52,19.68 55.88,19.05 49.53,19.05 D11.C
  Bottom 0.406: X3.A4 16.51,17.78 18.41,15.88 40.01,15.88 43.18,19.05 49.53,19.05 51.6,19.05 T6.2
N$39  (via drill 0.25, 0.25 pad 0.25)
  Top 0.254: v70.48,31.11 71.12,31.75 74.93,31.75 v75.56,31.11 76.83,29.84 v90.81,29.84
  Bottom 0.254: D30.A 75.14,30.68 v75.56,31.11 | v90.81,29.84 92.08,29.84 R64.2 | v70.48,31.11 70.48,26.67 71.95,25.2 IC1.3
N$40  (via drill 0.25, 0.25 pad 0.25)
  Top 0.254: v43.18,20.32 46.35,23.5 57.15,23.5 58.42,22.23 63.5,22.23 64.14,21.59 66.04,21.59 66.67,22.23 v77.47,22.23
  Bottom 0.254: 36.41,17.35 C7.1 | 36.41,17.35 R25.1 34.29,19.05 33.66,19.68 30.48,19.68 29.84,19.05 29.84,18.41 26.04,18.41 25.4,19.05 D14.C | 36.41,17.35 37.47,18.41 37.47,19.68 38.1,20.32 v43.18,20.32 | v77.47,22.23 77.95,22.7 IC1.15
N$41  (via drill 0.25 pad 0.25)
  Top 0.254: v78.11,21.59 66.67,21.59 66.04,20.95 64.14,20.95 62.87,19.68 v52.07,19.68
  Bottom 0.254: v52.07,19.68 41.91,19.68 40.64,18.41 R28.1 | v78.11,21.59 78.45,21.93 IC1.16
N$42  (via drill 0.25 pad 0.25)
  Top 0.254: v31.11,17.14 31.75,16.51 37.47,16.51 v38.1,17.14
  Bottom 0.254: D13.A 26.67,17.46 T7.1 28.75,17.14 v31.11,17.14 | v38.1,17.14 38.52,17.14 R28.2
N$43
  Top 0.61: LED7.A 27.72,18.41 R27.1
  Bottom 0.61: R27.1 T7.3
N$44  (via drill 0.25 pad 0.25)
  Top 0.254: v24.77,17.78 25.62,17.78 LED7.C
  Bottom 0.254: v24.77,17.78 24.34,17.78 R26.2
N$45  (1 unrouted)
  Top 0.61: R31.2 41.27,20.32 29.84,20.32 29.21,19.68 24.13,19.68 23.5,20.32 X3.A3
  Bottom 0.254: D16.A 43.81,22.86 R31.2 44.45,20.95 R30.1 | R25.2 35.14,20.32 26.67,20.32 D13.C
  Bottom 0.406: 13.97,20.32 26.67,20.32 28.75,20.32 T7.2
N$46  (via drill 0.25, 0.25 pad 0.25)
  Top 0.254: v67.94,10.16 69.22,11.43 v71.12,11.43
  Bottom 0.254: v67.94,10.16 67.94,8.89 68.26,8.57 | 68.26,8.57 D35.1 | 68.26,8.57 68.26,7.51 R50.1 | v71.12,11.43 71.12,13.97 72.45,15.3 IC1.41
N$47  (via drill 0.25, 0.25 pad 0.25)
  Top 0.254: v60.96,22.86 65.41,22.86 67.31,24.77 76.83,24.77 v78.11,26.04
  Bottom 0.254: D16.C 47.8,22.68 48.26,22.23 52.7,22.23 52.7,22.86 53.34,23.5 56.52,23.5 57.15,22.86 R29.1 57.78,22.86 59.27,21.38 C8.1 59.69,20.95 60.33,21.59 60.33,22.23 v60.96,22.86 | IC1.13 76.95,24.88 v78.11,26.04
N$48  (via drill 0.25 pad 0.25)
  Top 0.254: v64.77,22.23 65.41,22.23 67.31,24.13 78.11,24.13 v79.38,25.4
  Bottom 0.254: R32.1 v64.77,22.23 | v79.38,25.4 78.11,25.4 77.47,24.77 77.47,23.91 IC1.14
N$49  (via drill 0.25 pad 0.25)
  Top 0.254: v53.98,20.32 v60.96,20.32
  Bottom 0.254: D15.A 49.4,21.27 T8.1 52.56,20.32 v53.98,20.32 | v60.96,20.32 62.02,21.38 R32.2
N$50
  Top 0.61: LED8.A 50.58,22.23 R31.1
  Bottom 0.61: R31.1 T8.3
N$51  (via drill 0.25 pad 0.25)
  Top 0.254: LED8.C 48.48,20.73 v48.26,20.95
  Bottom 0.254: v48.26,20.95 R30.2
N$52
  Top 0.61: R35.2 17.14,23.5 16.51,22.86 X3.A2
  Bottom 0.254: D18.A 21.59,24.77 R35.2 20.32,22.86 20.95,22.23 R34.1 | R29.2 59.27,23.28 58.42,24.13 49.53,24.13 D15.C
  Bottom 0.406: X3.A2 16.51,22.86 18.41,20.95 40.01,20.95 43.18,24.13 49.53,24.13 51.6,24.13 T8.2
N$53  (via drill 0.25, 0.25 pad 0.25)
  Top 0.254: v70.48,12.06 73.03,12.06 73.66,11.43 v82.55,11.43
  Bottom 0.254: D35.4 70.48,11.23 v70.48,12.06 70.48,13.97 71.95,15.44 IC1.42 | v82.55,11.43 R51.2
N$54  (via drill 0.25 pad 0.25)
  Top 0.254: v76.2,26.67 75.56,26.04 66.04,26.04 64.77,24.77 v52.7,24.77
  Bottom 0.254: D18.C 26.21,23.5 29.84,23.5 29.84,24.13 30.48,24.77 34.29,24.77 34.92,24.13 | 34.92,24.13 R33.1 | 34.92,24.13 34.92,23.71 C9.1 37.47,23.5 37.47,24.77 v52.7,24.77 | IC1.11 75.95,26.42 v76.2,26.67
N$55  (via drill 0.25, 0.25 pad 0.25)
  Top 0.254: v41.27,24.13 64.77,24.13 66.04,25.4 76.2,25.4 v76.83,26.04
  Bottom 0.254: v41.27,24.13 40.64,23.5 R36.1 | IC1.12 76.45,25.65 v76.83,26.04
N$56  (via drill 0.25 pad 0.25)
  Top 0.254: v31.11,22.23 31.75,21.59 37.47,21.59 v38.1,22.23
  Bottom 0.254: D17.A 26.54,22.55 T9.1 28.57,22.38 28.57,22.23 v31.11,22.23 | R36.2 38.52,22.64 v38.1,22.23
N$57
  Top 0.61: LED9.A 27.72,23.5 R35.1
  Bottom 0.61: R35.1 T9.3
N$58  (via drill 0.25 pad 0.25)
  Top 0.254: v24.77,22.23 25.4,22.23 25.4,21.18 LED9.C
  Bottom 0.254: R34.2 v24.77,22.23
N$59  (1 unrouted)
  Top 0.61: R39.2 41.27,25.4 X3.A1
  Bottom 0.254: R38.1 43.81,26.04 43.18,26.67 R39.2 43.18,27.94 43.81,28.57 D20.A | 28.57,25.4 34.29,25.4 | 34.29,25.4 34.71,25.4 | R33.2 35.14,25.4 34.29,25.4 | 26.67,25.4 D17.C
  Bottom 0.406: X3.A1 18.41,25.4 19.05,26.04 26.04,26.04 26.67,25.4 28.75,25.4 T9.2
N$60  (via drill 0.25)
  Top 0.254: v75.56,12.06 73.66,12.06 73.03,12.7 v69.22,12.7
  Bottom 0.254: D35.3 69.53,10.47 69.22,10.79 v69.22,12.7 69.22,13.34 71.45,15.57 IC1.43 | v75.56,12.06 76.2,11.43 R52.1
N$61  (via drill 0.25 pad 0.25)
  Top 0.254: v60.96,28.57 v74.3,28.57
  Bottom 0.254: 57.66,27.83 59.17,26.14 | 59.17,26.14 C10.1 | 57.66,27.83 R37.1 | 57.66,27.83 56.94,28.57 53.34,28.57 52.7,27.94 52.7,27.3 48.73,27.3 D20.C | v60.96,28.57 60.33,27.94 60.33,26.67 59.69,26.04 59.17,26.14 | v74.3,28.57 74.3,27.94 74.95,27.29 IC1.9
N$62  (via drill 0.25 pad 0.25)
  Top 0.254: v65.41,27.3 v75.56,27.3
  Bottom 0.254: R40.1 64.77,26.67 v65.41,27.3 | IC1.10 75.45,27.19 v75.56,27.3
N$63  (via drill 0.25 pad 0.25)
  Top 0.254: v53.98,25.4 60.33,25.4 v60.96,25.82
  Bottom 0.254: D19.A 49.4,26.36 T10.1 51.6,25.86 52.07,25.4 v53.98,25.4 | v60.96,25.82 60.96,26.67 R40.2
N$64
  Top 0.61: LED10.A 50.58,27.3 R39.1
  Bottom 0.61: R39.1 T10.3
N$65  (via drill 0.25 pad 0.25)
  Top 0.254: LED10.C 48.48,25.82 48.26,25.82 48.26,26.67 v47.62,26.67
  Bottom 0.254: v47.62,26.67 47.2,26.67 R38.2
N$66
  Top 0.61: X2.A3 R43.2
  Bottom 0.254: D22.A 21.59,31.11 R43.2 20.32,29.21 20.95,28.57 R42.1 | R37.2 58.42,29.21 49.53,29.21 D19.C
  Bottom 0.406: X2.A3 15.88,29.84 19.05,26.67 39.37,26.67 42.55,29.84 48.9,29.84 49.53,29.21 51.6,29.21 T10.2
N$67
  Bottom 0.254: D35.6 71.44,8.57 71.44,7.3 70.48,6.35 69.85,6.35 | 69.85,6.35 66.67,6.35 66.67,11.43 70.95,15.71 IC1.44 | R49.1 69.85,6.35
N$68  (via drill 0.25 pad 0.25)
  Top 0.254: v73.03,27.94 58.42,27.94 58.42,30.48 v52.07,30.48
  Bottom 0.254: D22.C 24.95,30.93 26.04,29.84 29.84,29.84 29.84,30.48 30.48,31.11 34.08,31.11 R41.1 35.77,29 36.2,28.57 36.2,28.79 | 36.2,28.79 C11.1 | v52.07,30.48 51.44,31.11 37.47,31.11 37.47,29.21 36.2,29.21 36.2,28.79 | v73.03,27.94 73.03,26.67 73.95,25.75 IC1.7
N$69  (via drill 0.25 pad 0.25)
  Top 0.254: v74.3,26.67 57.78,26.67 57.78,29.84 v41.27,29.84
  Bottom 0.254: R44.1 v41.27,29.84 | v74.3,26.67 74.45,26.52 IC1.8
N$70  (via drill 0.25 pad 0.25)
  Top 0.254: v31.11,27.94 31.75,27.3 37.25,27.3 v37.88,27.94
  Bottom 0.254: D21.A 26.67,28.89 T11.1 28.75,27.94 v31.11,27.94 | R44.2 38.52,28.57 v37.88,27.94
N$71
  Top 0.61: LED11.A 27.72,29.84 R43.1
  Bottom 0.61: R43.1 T11.3
N$72  (via drill 0.25 pad 0.25)
  Top 0.254: v24.77,28.57 25.62,28.57 LED11.C
  Bottom 0.254: v24.77,28.57 R42.2
N$73
  Bottom 0.254: D28.C D29.C 85.09,24.13 | 85.09,24.13 83.82,24.13 83.82,26.24 D32.C 80.64,26.67 80.64,28.57 D31.C 79.38,28.57 76.2,31.75 L1.1 76.2,34.29 73.66,34.29 D30.C 73.66,35.56 73.44,35.77 R53.1 | D34.C 85.09,24.13
N$74
  Bottom 0.254: R64.1 89.68,31.33 D27.K
N$75  (via drill 0.25, 0.25 pad 0.25, 0.25 pad 0.61)
  Top 0.254: v71.75,30.48 v65.41,30.48 v59.69,30.48
  Bottom 0.254: D24.C 48.44,34.11 48.9,33.66 52.7,33.66 52.7,34.29 53.34,34.92 R45.1 C12.1 59.05,32.8 59.05,31.11 v59.69,30.48 | v65.41,30.48 D33.C | v71.75,30.48 71.75,26.67 72.95,25.48 IC1.5
N$76  (via drill 0.25 pad 0.25, 0.25 pad 0.61)
  Top 0.254: v63.5,29.21 v72.39,29.21
  Bottom 0.254: v72.39,29.21 72.39,26.67 73.45,25.61 IC1.6 | R48.1 63.08,29.63 v63.5,29.21
N$77  (via drill 0.25, 0.25 pad 0.25)
  Top 0.254: v53.98,31.75 v60.33,31.75
  Bottom 0.254: 51.44,32.7 49.4,32.7 D23.A | 51.44,32.7 T12.1 | v53.98,31.75 52.07,31.75 51.44,32.7 | v60.33,31.75 R48.2
N$78
  Top 0.254: LED12.A 50.8,31.34
  Top 0.61: 50.8,31.34 50.8,33.66 R47.1
  Bottom 0.61: R47.1 T12.3
N$79  (via drill 0.25 pad 0.25)
  Top 0.254: v48.26,32.38 48.26,31.75 48.9,31.11 LED12.C
  Bottom 0.254: R46.2 v48.26,32.38
N$80  (via drill 0.25, 0.25 pad 0.25)
  Top 0.254: v60.96,36.83 v72.39,36.83
  Bottom 0.254: 59.2,35.02 58.42,36.2 49.53,36.2 D23.C | 59.2,35.02 R45.2 | T12.2 51.44,34.29 | v60.96,36.83 59.2,35.07 59.2,35.02 | v72.39,36.83 76.2,36.83 L1.2
  Bottom 0.406: 42.55,36.2 41.27,34.92
  Bottom 0.61: X2.A1 15.88,34.92 16.51,34.29 40.64,34.29 42.55,36.2 49.53,36.2 51.6,36.2 T12.2
N$81
  Bottom 0.406: CON2.5 D27.A
N$82
  Bottom 0.254: D26.K 95.25,34.92 R62.1
N$83
  Bottom 0.254: D33.A 65.42,34.09 C13.1 R53.2 70.48,33.66 71.12,33.02 71.12,26.67 72.45,25.34 IC1.4
N$84
  Top 0.61: R47.2 17.78,33.66 16.51,32.38 X2.A2
  Bottom 0.254: D24.A 44.27,34.92 R47.2 44.45,32.38 R46.1 | R41.2 35.14,31.75 28.75,31.75 | 26.67,31.75 D21.C
  Bottom 0.406: X2.A2 26.04,32.38 26.67,31.75 28.75,31.75 T11.2
  Bottom 0.61: T11.2 28.57,30.8
N$85  (via drill 0.25)
  Top 0.254: JP2.2 88.9,7.62 88.9,12.7 76.83,12.7 76.2,13.34 v75.56,13.34
  Bottom 0.254: IC1.35 75.45,13.45 v75.56,13.34
N$86  (via drill 0.25)
  Top 0.254: v71.75,4.45 76.83,4.45 v77.47,3.81 | v77.47,1.27 v87,1.27
  Bottom 0.254: D35.5 72.39,9.53 72.39,7.62 71.75,6.99 v71.75,4.45 | R55.1 R56.1 87.21,12.28 | v87,1.27 87,12.06 87.21,12.28 | v77.47,3.81 v77.47,1.27 | 87.21,12.28 R54.1
N$87  (via drill 0.25)
  Top 0.254: v74.3,12.7 73.66,12.7 73.03,13.34 v66.67,13.34
  Bottom 0.254: R59.1 65.41,12.06 v66.67,13.34 | IC1.37 74.45,12.86 v74.3,12.7
N$88
  Bottom 0.254: R58.1 73.66,13.34 73.95,13.62 IC1.38
N$89
  Bottom 0.254: R57.1 72.81,13.12 73.45,13.76 IC1.39
N$90  (via drill 0.25, 0.25 pad 0.2)
  Top 0.254: v87.63,19.05 83.82,19.05 v83.82,16.51 83.82,15.24 v76.2,15.24
  Bottom 0.254: R60.1 90.6,19.27 R61.1 87.84,19.27 v87.63,19.05 | v83.82,16.51 C15.1 | IC1.33 76.45,15.49 v76.2,15.24
N$91  (via drill 0.25)
  Top 0.254: JP1.2 91.44,17.78 88.27,14.61 73.03,14.61 v72.39,13.97
  Bottom 0.254: v72.39,13.97 72.95,14.53 IC1.40
N$92  (via drill 0.25, 0.25 pad 0.25, 0.38)
  Top 0.254: CON1.2 74.93,5.71 74.3,5.08 v73.03,5.08 | v84.45,4.45 v88.27,4.45
  Bottom 0.254: v73.03,5.08 73.03,3.17 72.81,2.96 R49.2 | v88.27,4.45 R56.2 | CON1.2 80.01,4.45 v84.45,4.45
N$93  (via drill 0.25)
  Top 0.254: v75.56,5.08 77.47,5.08 78.11,4.45 80.01,4.45 CON1.3
  Bottom 0.254: R52.2 76.2,7.62 75.56,6.99 v75.56,5.08
N$94
  Bottom 0.254: R54.2 85.31,14.61 R51.1 85.09,11.43 85.09,9.53 CON1.4
N$95  (via drill 0.25, 0.25 pad 0.25)
  Top 0.254: CON1.5 v90.81,3.17 90.81,0.64 68.58,0.64 v67.94,1.27
  Bottom 0.254: v67.94,1.27 R50.2 | v90.81,3.17 R55.2
N$96  (via drill 0.25)
  Top 0.254: v76.2,13.97 v88.27,13.97 | v88.27,16.51 88.9,17.14 v88.9,22.23
  Bottom 0.254: T2B.1 94.61,22.23 93.98,21.59 91.22,21.59 R60.2 89.33,21.17 | 89.33,21.17 C16.2 | v88.27,13.97 v88.27,16.51 | v88.9,22.23 88.91,21.59 89.33,21.17 | v76.2,13.97 76.95,14.72 IC1.32
N$97  (via drill 0.25)
  Top 0.254: v77.47,13.34 v90.81,13.34
  Bottom 0.254: T1A.1 94.61,16.51 91.02,16.51 C17.2 | C17.2 90.17,16.3 R61.2 | v90.81,13.34 C17.2 | IC1.31 77.45,13.36 v77.47,13.34
N$98  (via drill 0.25 pad 0.25)
  Top 0.254: CON2.4 82.55,33.02 v88.27,33.02
  Bottom 0.254: v88.27,33.02 88.27,34.92 D26.A
N$99
  Bottom 0.254: D25.K 83.55,37.05 R63.2
N$100
  Bottom 0.406: CON2.2 78.74,36.05 D25.A
VCC  (via drill 0.25, 0.25 pad 0.25)
  Top 0.254: v63.5,3.81 v74.3,3.81 | JP2.3 90.17,5.08 89.53,5.71 CON1.6 83.82,5.08 82.55,3.81 82.55,2.54 81.92,1.91 78.11,1.91 77.47,2.54 v74.3,2.54
  Bottom 0.254: R59.2 C14.2 64.35,7.2 63.5,6.99 v63.5,3.81 | 74.08,9.31 R58.2 | 74.08,9.31 74.08,9.11 74.51,8.68 R57.2 74.3,6.13 v74.3,3.81 v74.3,2.54 | JP2.3 95.89,5.08 95.89,13.97 JP1.3 | 74.08,9.31 74.95,10.18 IC1.36 74.95,18.41 75.95,18.41 IC1.34

### Text on the board
Top: Supervisor Rev 0.4 | VMODE | TOS
Bottom: Markus Walser 2009